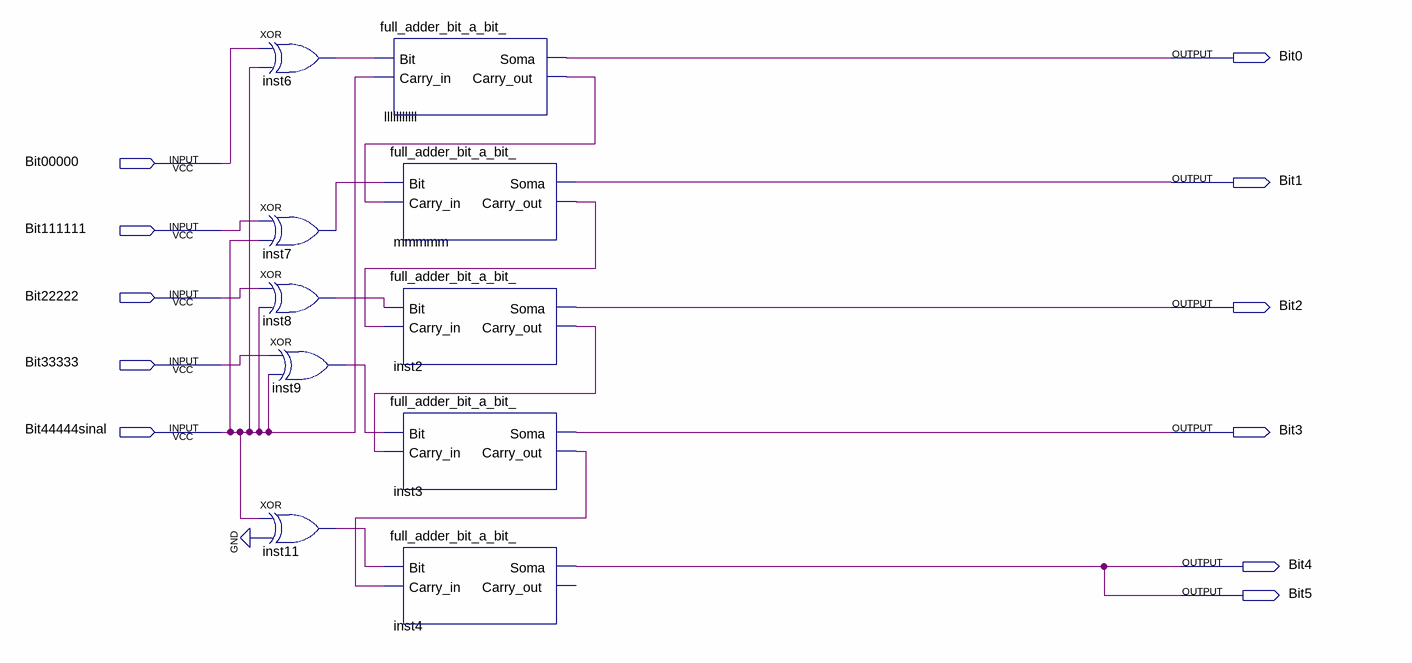
[diagram p0: schematic sheet]
// Quartus schematic complemento_2_Bit.bdf as structural Verilog: 10 symbols, 11 pins
module complemento_2_Bit (
  input  Bit00000,
  input  Bit111111,
  input  Bit22222,
  input  Bit33333,
  input  Bit44444sinal,
  output Bit0,
  output Bit1,
  output Bit2,
  output Bit3,
  output Bit4,
  output Bit5
);

  wire inst2_carry_out, inst3_carry_out, inst6_out, inst7_out, inst8_out, inst9_out, inst11_out,
       lllllllllll_carry_out, mmmmm_carry_out;

  xor inst6 (inst6_out, Bit00000, Bit44444sinal);
  xor inst7 (inst7_out, Bit111111, Bit44444sinal);
  xor inst8 (inst8_out, Bit22222, Bit44444sinal);
  xor inst9 (inst9_out, Bit33333, Bit44444sinal);
  xor inst11 (inst11_out, Bit44444sinal, 1'b0);
  full_adder_bit_a_bit_ lllllllllll (
    .Bit(inst6_out), .Carry_in(Bit44444sinal), .Soma(Bit0), .Carry_out(lllllllllll_carry_out));
  full_adder_bit_a_bit_ mmmmm (
    .Bit(inst7_out), .Carry_in(lllllllllll_carry_out), .Soma(Bit1), .Carry_out(mmmmm_carry_out));
  full_adder_bit_a_bit_ inst2 (.Bit(inst8_out), .Carry_in(mmmmm_carry_out), .Soma(Bit2), .Carry_out(inst2_carry_out));
  full_adder_bit_a_bit_ inst3 (.Bit(inst9_out), .Carry_in(inst2_carry_out), .Soma(Bit3), .Carry_out(inst3_carry_out));
  full_adder_bit_a_bit_ inst4 (.Bit(inst11_out), .Carry_in(inst3_carry_out), .Soma(Bit4));  // open: Carry_out

  assign Bit5 = Bit4;
endmodule
